# Altium schematic sheet Driver.SchDoc
size A4; Organization: Altium Limited; Address1: L3, 12a Rodborough Rd; Address2: Frenchs Forest; Address3: NSW; Address4: Australia 2086; SheetNumber: 5; SheetTotal: 7
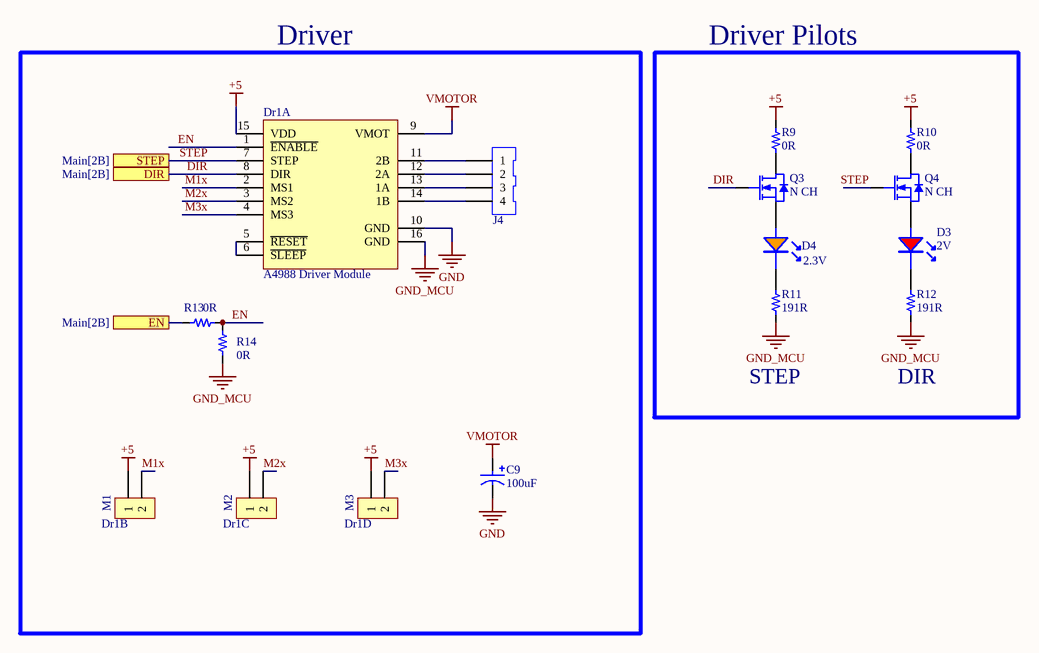
[diagram p0: Driver.SchDoc]

## Parts
C9  value 100uF  [CAP_TH]  (hidden comment: Cap_100uF_Electr_TH_50V)
D3  2V  [0805_LED]
D4  2.3V  [0805_LED]
Dr1  A4988 Driver Module  [A4988 Module]  (parts A,B,C,D of 4)
J4  CONN HEADER TH 4POS 2.5mm  [JST_B4B-XH-A]  (value not drawn)
Q3  N CH  [SOT_23_3]
Q4  N CH  [SOT_23_3]
R9  value 0R  [0603_res]  (hidden comment: 0R 1/10W)
R10  value 0R  [0603_res]  (hidden comment: 0R 1/10W)
R11  value 191R  [0603_res]  (hidden comment: 191R 1/10W)
R12  value 191R  [0603_res]  (hidden comment: 191R 1/10W)
R13  value 0R  [0603_res]  (hidden comment: 0R 1/10W)
R14  value 0R  [0603_res]  (hidden comment: 0R 1/10W)

## Blocks framed on the sheet
Driver: C9 Dr1 J4 R13 R14
Driver Pilots: D3 D4 Q3 Q4 R9-R12

## Ports
DIR (see Main[2B]), EN (see Main[2B]), STEP (see Main[2B])

## Nets
+5: Dr1.15(VDD) Dr1.17(1) Dr1.19(1) Dr1.21(1) R9.2 R10.2
GND: C9.2 Dr1.10(GND)
GND_MCU: Dr1.16(GND) R11.1 R12.1 R14.1
VMOTOR: C9.1 Dr1.9(VMOT)
DIR: Dr1.8(DIR) Q3.1(G) ; port DIR
EN: Dr1.1(~{ENABLE}) R13.2 R14.2
EN: R13.1 ; port EN  [a separate net that carries the same name]
M1x: Dr1.2(MS1) Dr1.18(2)
M2x: Dr1.3(MS2) Dr1.20(2)
M3x: Dr1.4(MS3) Dr1.22(2)
STEP: Dr1.7(STEP) Q4.1(G) ; port STEP
NetD3_1: D3.1(A) Q4.2(S)
NetD3_2: D3.2 R12.2
NetD4_1: D4.1(A) Q3.2(S)
NetD4_2: D4.2 R11.2
NetDr1_5: Dr1.5(~{RESET}) Dr1.6(~{SLEEP})
NetDr1_11: Dr1.11(2B) J4.1
NetDr1_12: Dr1.12(2A) J4.2
NetDr1_13: Dr1.13(1A) J4.3
NetDr1_14: Dr1.14(1B) J4.4
NetQ3_3: Q3.3(D) R9.1
NetQ4_3: Q4.3(D) R10.1

## Notes on the sheet
- STEP
- DIR
- Title
- Size:
- Date:
- A4
- Number:
- Time:
- Revision:
- Sheet
- of
- File:
- (in symbol A4988 Driver Module, part B) M1
- (in symbol A4988 Driver Module, part C) M2
- (in symbol A4988 Driver Module, part D) M3

## Library data of the parts
D3 = LED_0805_RED: LED RED CLEAR 0805 SMD; Manufacturer: XINGLIGHT; Manufacturer Part Number: XL-2012SURC; Supplier 1: LCSC; Supplier Part Number 1: C965812; ComponentLink1Description: LCSC; ComponentLink1URL: https://www.lcsc.com/product-detail/Light-Emitting-Diodes-LED_XINGLIGHT-XL-2012SURC_C965812.html
D4 = LED_0805_Orange: LED ORANGE WATER CLEAR 0805 SMD; Manufacturer: XINGLIGHT; Manufacturer Part Number: XL-2012UOC; Supplier 1: LCSC; Supplier Part Number 1: C965813; ComponentLink1Description: LCSC; ComponentLink1URL: https://www.lcsc.com/product-detail/C965813.html?s_z=n_XINGLIGHT%2520XL-2012
J4 = Connector JST 4pin: 4P XH 1x4P Tin -25℃~+85℃ White 2.5mm 250V 4 3A 1 Through Hole Through Hole,P=2.5mm Headers, Male Pins RoHS; Manufacturer: JST; Manufacturer Part Number: B4B-XH-A(LF)(SN); Supplier 1: LCSC; Supplier Part Number 1: C144395; ComponentLink1Description: LCSC; ComponentLink1URL: https://www.lcsc.com/product-detail/C144395.html?s_z=n_JST%2520b4b
Q3 Q4 = Q_NFET_50V_200mA_SOT23: MOSFET N-CH 50V 200mA SOT-23; Manufacturer: onsemi; Manufacturer Part Number: BSS138LT1G; Supplier 1: LCSC; Supplier Part Number 1: C82045; ComponentLink1Description: LCSC; ComponentLink1URL: https://www.lcsc.com/product-detail/C82045.html
R9 R10 R13 R14 = Res_0R_0603_1/10W: RES SMD 0R OHM 5% 1/10W 0603; Manufacturer: FOJAN; Manufacturer Part Number: FRC0603P000 TS; ComponentLink1URL: https://www.lcsc.com/product-detail/Chip-Resistor-Surface-Mount_FOJAN-FRC0603P000-TS_C2907080.html; Supplier 1: LCSC; Supplier Part Number 1: C2907080; ComponentLink1Description: LCSC
R11 R12 = Res_191R_0603_1/10W: 100mW Thick Film Resistor 75V ±100ppm/℃ ±1% 191Ω 0603 Chip Resistor - Surface Mount ROHS; Manufacturer: FOJAN; Manufacturer Part Number: FRC0603F1910TS; ComponentLink1URL: https://lcsc.com/product-detail/Chip-Resistor-Surface-Mount_FOJAN-FRC0603F1910TS_C3000718.html; Supplier 1: LCSC; Supplier Part Number 1: C3000718; ComponentLink1Description: LCSC
C9 = Cap_100uF_Electr_TH_50V: Supplier 1: LCSC; ComponentLink1Description: LCSC